# EAGLE design trig_board (EAGLE 9.2.0)
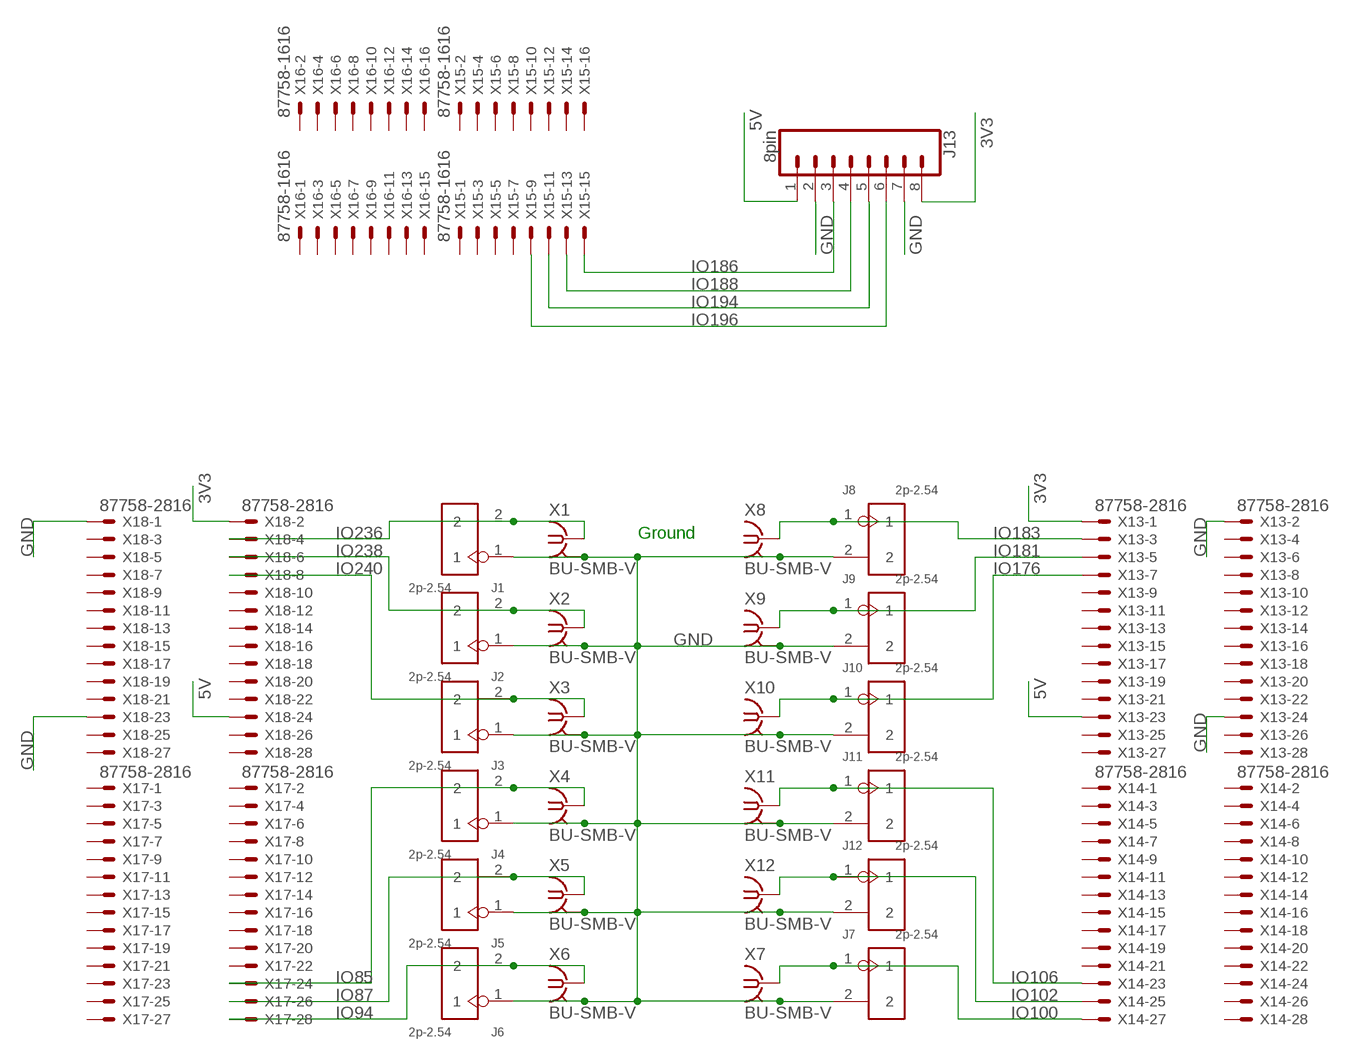
[diagram p0: schematic, sheet 1]

## Parts
J1  2p-2.54  DIP-BLACK-MALE-HEADER-VERT(2P-2.54)  [H2-2.54]
J2  2p-2.54  DIP-BLACK-MALE-HEADER-VERT(2P-2.54)  [H2-2.54]
J3  2p-2.54  DIP-BLACK-MALE-HEADER-VERT(2P-2.54)  [H2-2.54]
J4  2p-2.54  DIP-BLACK-MALE-HEADER-VERT(2P-2.54)  [H2-2.54]
J5  2p-2.54  DIP-BLACK-MALE-HEADER-VERT(2P-2.54)  [H2-2.54]
J6  2p-2.54  DIP-BLACK-MALE-HEADER-VERT(2P-2.54)  [H2-2.54]
J7  2p-2.54  DIP-BLACK-MALE-HEADER-VERT(2P-2.54)  [H2-2.54]
J8  2p-2.54  DIP-BLACK-MALE-HEADER-VERT(2P-2.54)  [H2-2.54]
J9  2p-2.54  DIP-BLACK-MALE-HEADER-VERT(2P-2.54)  [H2-2.54]
J10  2p-2.54  DIP-BLACK-MALE-HEADER-VERT(2P-2.54)  [H2-2.54]
J11  2p-2.54  DIP-BLACK-MALE-HEADER-VERT(2P-2.54)  [H2-2.54]
J12  2p-2.54  DIP-BLACK-MALE-HEADER-VERT(2P-2.54)  [H2-2.54]
J13  8pin  CONN_08"  [1X08]
X1  BU-SMB-V  [BU-SMB-V]
X2  BU-SMB-V  [BU-SMB-V]
X3  BU-SMB-V  [BU-SMB-V]
X4  BU-SMB-V  [BU-SMB-V]
X5  BU-SMB-V  [BU-SMB-V]
X6  BU-SMB-V  [BU-SMB-V]
X7  BU-SMB-V  [BU-SMB-V]
X8  BU-SMB-V  [BU-SMB-V]
X9  BU-SMB-V  [BU-SMB-V]
X10  BU-SMB-V  [BU-SMB-V]
X11  BU-SMB-V  [BU-SMB-V]
X12  BU-SMB-V  [BU-SMB-V]
X13  87758-2816  [87758-2816]
X14  87758-2816  [87758-2816]
X15  87758-1616  [87758-1616]
X16  87758-1616  [87758-1616]
X17  87758-2816  [87758-2816]
X18  87758-2816  [87758-2816]

## Nets
3V3: J13.8 X13.1 X18.2
5V: J13.1 X13.23 X18.24
GND: J1.1 J2.1 J3.1 J4.1 J5.1 J6.1 J7.2 J8.2 J9.2 J10.2 J11.2 J12.2 J13.2 J13.7 X1.2 X1.3 X1.4 X1.5 X2.2 X2.3 X2.4 X2.5 X3.2 X3.3 X3.4 X3.5 X4.2 X4.3 X4.4 X4.5 X5.2 X5.3 X5.4 X5.5 X6.2 X6.3 X6.4 X6.5 X7.2 X7.3 X7.4 X7.5 X8.2 X8.3 X8.4 X8.5 X9.2 X9.3 X9.4 X9.5 X10.2 X10.3 X10.4 X10.5 X11.2 X11.3 X11.4 X11.5 X12.2 X12.3 X12.4 X12.5 X13.2 X13.24 X18.1 X18.23
IO85: J4.2 X4.1 X17.24
IO87: J5.2 X5.1 X17.26
IO94: J6.2 X6.1 X17.28
IO100: J7.1 X7.1 X14.27
IO102: J12.1 X12.1 X14.25
IO106: J11.1 X11.1 X14.23
IO176: J10.1 X10.1 X13.7
IO181: J9.1 X9.1 X13.5
IO183: J8.1 X8.1 X13.3
IO186: J13.3 X15.15
IO188: J13.4 X15.13
IO194: J13.5 X15.11
IO196: J13.6 X15.9
IO236: J1.2 X1.1 X18.4
IO238: J2.2 X2.1 X18.6
IO240: J3.2 X3.1 X18.8
Unconnected: X13.4 X13.6 X13.8 X13.9 X13.10 X13.11 X13.12 X13.13 X13.14 X13.15 X13.16 X13.17 X13.18 X13.19 X13.20 X13.21 X13.22 X13.25 X13.26 X13.27 X13.28 X14.1 X14.2 X14.3 X14.4 X14.5 X14.6 X14.7 X14.8 X14.9 X14.10 X14.11 X14.12 X14.13 X14.14 X14.15 X14.16 X14.17 X14.18 X14.19 X14.20 X14.21 X14.22 X14.24 X14.26 X14.28 X15.1 X15.2 X15.3 X15.4 X15.5 X15.6 X15.7 X15.8 X15.10 X15.12 X15.14 X15.16 X16.1 X16.2 X16.3 X16.4 X16.5 X16.6 X16.7 X16.8 X16.9 X16.10 X16.11 X16.12 X16.13 X16.14 X16.15 X16.16 X17.1 X17.2 X17.3 X17.4 X17.5 X17.6 X17.7 X17.8 X17.9 X17.10 X17.11 X17.12 X17.13 X17.14 X17.15 X17.16 X17.17 X17.18 X17.19 X17.20 X17.21 X17.22 X17.23 X17.25 X17.27 X18.3 X18.5 X18.7 X18.9 X18.10 X18.11 X18.12 X18.13 X18.14 X18.15 X18.16 X18.17 X18.18 X18.19 X18.20 X18.21 X18.22 X18.25 X18.26 X18.27 X18.28

## Notes on the sheet
- Ground

## Library data of the parts
J1-J12 = Seeed-Connector:DIP-BLACK-MALE-HEADER-VERT(2P-2.54): 320020016; MPN: P125-1102A0BS116A1
J13 = SparkFun-Connectors:CONN_08: Multi connection point. Often used as Generic Header-pin footprint for 0.1 inch spaced/style header connections On any of the 0.1 inch spaced packages, you can populate with these: Break Away Headers - Straight <https://www.sparkfun.com/products/116> (PRT-00116) Break Away Male Headers - Right Angle <https://www.sparkfun.com/products/553> (PRT-00553) Female Headers <https://www.sparkfun.com/products/115> (PRT-00115) Break Away Headers - Machine Pin <https://www.sparkfun.com/products/117> (PRT-00117) Break Away Female Headers - Swiss Machine Pin <https://www.sparkfun.com/products/743> (PRT-00743) Arduino Stackable Header - 8 Pin <https://www.sparkfun.com/products/9279> (PRT-09279) For SCREWTERMINALS and SPRING TERMINALS visit here: Screw Terimnals on SparkFun.com <https://www.sparkfun.com/search/results?term=Screw+Terminals> (5mm/3.5mm/2.54mm spacing) This device is also useful as a general connection point to wire up your design to another part of your project. Our various solder wires solder well into these plated through hole pads. Hook-Up Wire - Assortment (Stranded, 22 AWG) <https://www.sparkfun.com/products/11375> (PRT-11375) Hook-Up Wire - Assortment (Solid Core, 22 AWG) <https://www.sparkfun.com/products/11367> (PRT-11367) View the entire wire category on our website here <https://www.sparkfun.com/categories/141> Special notes: Molex polarized connector foot print use with SKU : PRT-08231 with associated crimp pins and housings. 1MM SMD Version SKU: PRT-10208 NOTES ON THE VARIANTS LOCK and LOCK_LONGPADS... This footprint was designed to help hold the alignment of a through-hole component (i.e. 6-pin header) while soldering it into place. You may notice that each hole has been shifted either up or down by 0.005 of an inch from it's more standard position (which is a perfectly straight line). This slight alteration caused the pins (the squares in the middle) to touch the edges of the holes. Because they are alternating, it causes a "brace" to hold the component in place. 0.005 has proven to be the perfect amount of "off-center" position when using our standard breakaway headers. Although looks a little odd when you look at the bare footprint, once you have a header in there, the alteration is very hard to notice. Also,if you push a header all the way into place, it is covered up entirely on the bottom side.; PROD_ID: CONN-08438
X1-X12 = con-coax:BU-SMB-V: FEMALE SMB CONNECTOR Radiall distributor RS 112-2993; OC_FARNELL: unknown; OC_NEWARK: unknown
X13 X14 X17 X18 = con-molex:87758-2816: 28 Pin - 2mm Dual Row Single Wafer, Vertical T/H HDR Source: http://www.molex.com/pdm_docs/sd/877580616_sd.pdf; MF: MOLEX; MPN: 87758-2816; OC_FARNELL: unknown; OC_NEWARK: 25M5681
X15 X16 = con-molex:87758-1616: 16 Pin - 2mm Dual Row Single Wafer, Vertical T/H HDR Source: http://www.molex.com/pdm_docs/sd/877580616_sd.pdf; MF: MOLEX; MPN: 87758-1616; OC_FARNELL: 7472366; OC_NEWARK: 59J1563

## Board
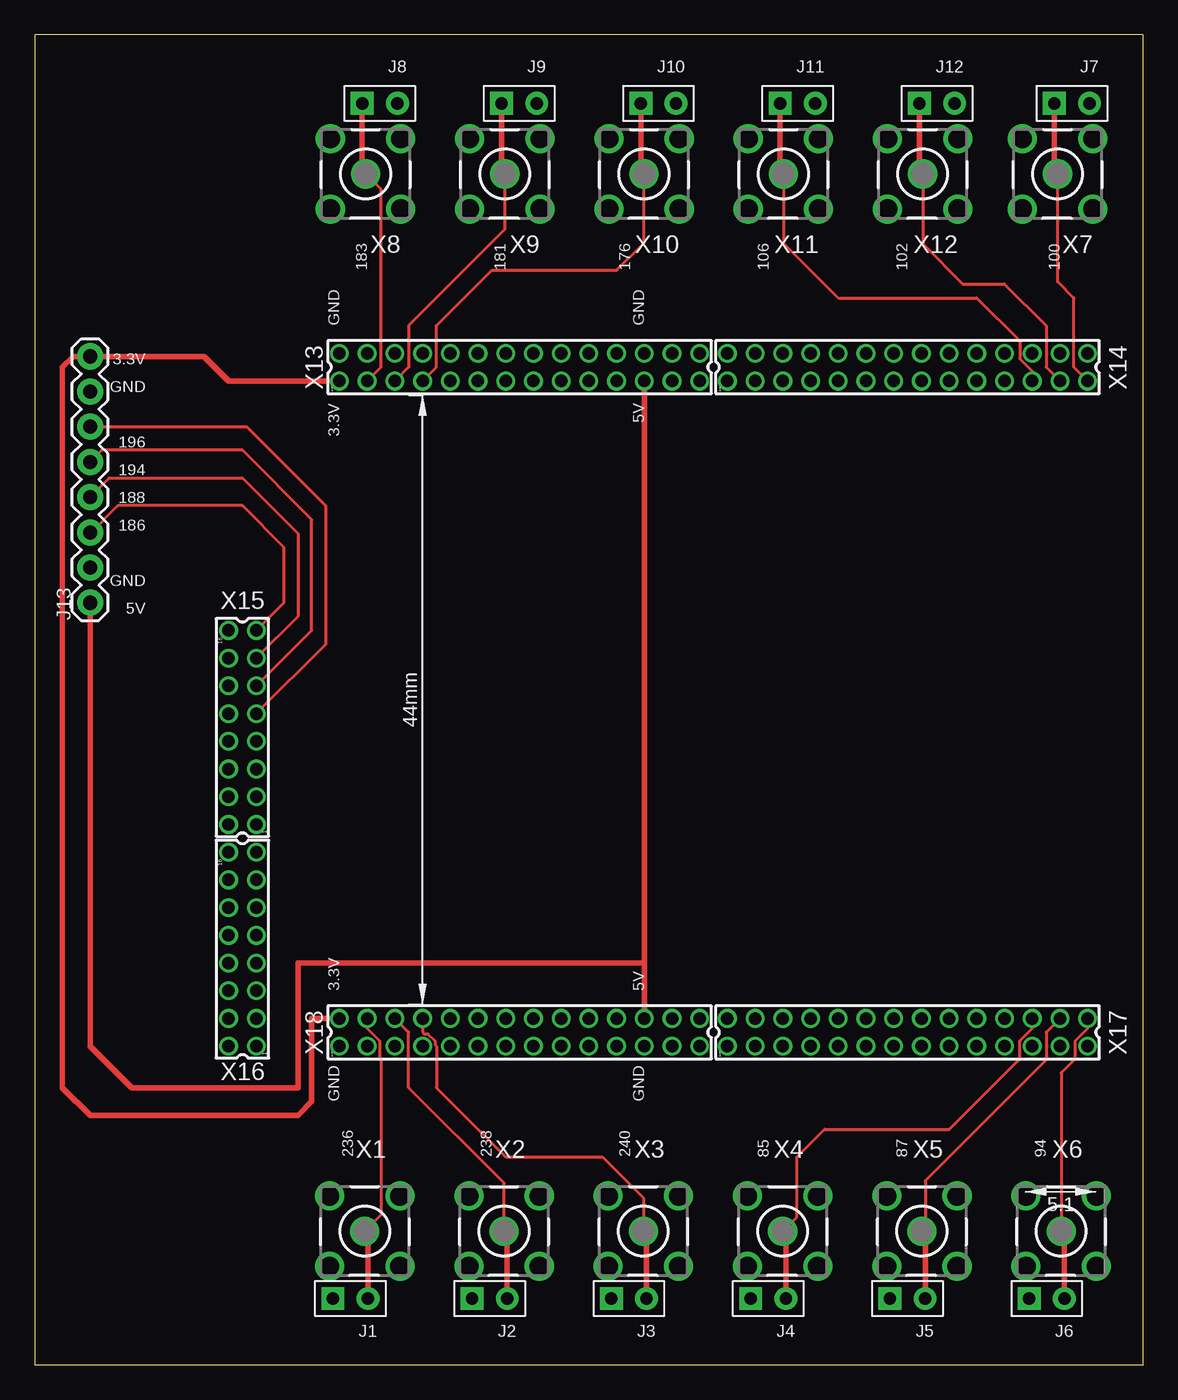
[diagram p1: board, top side]
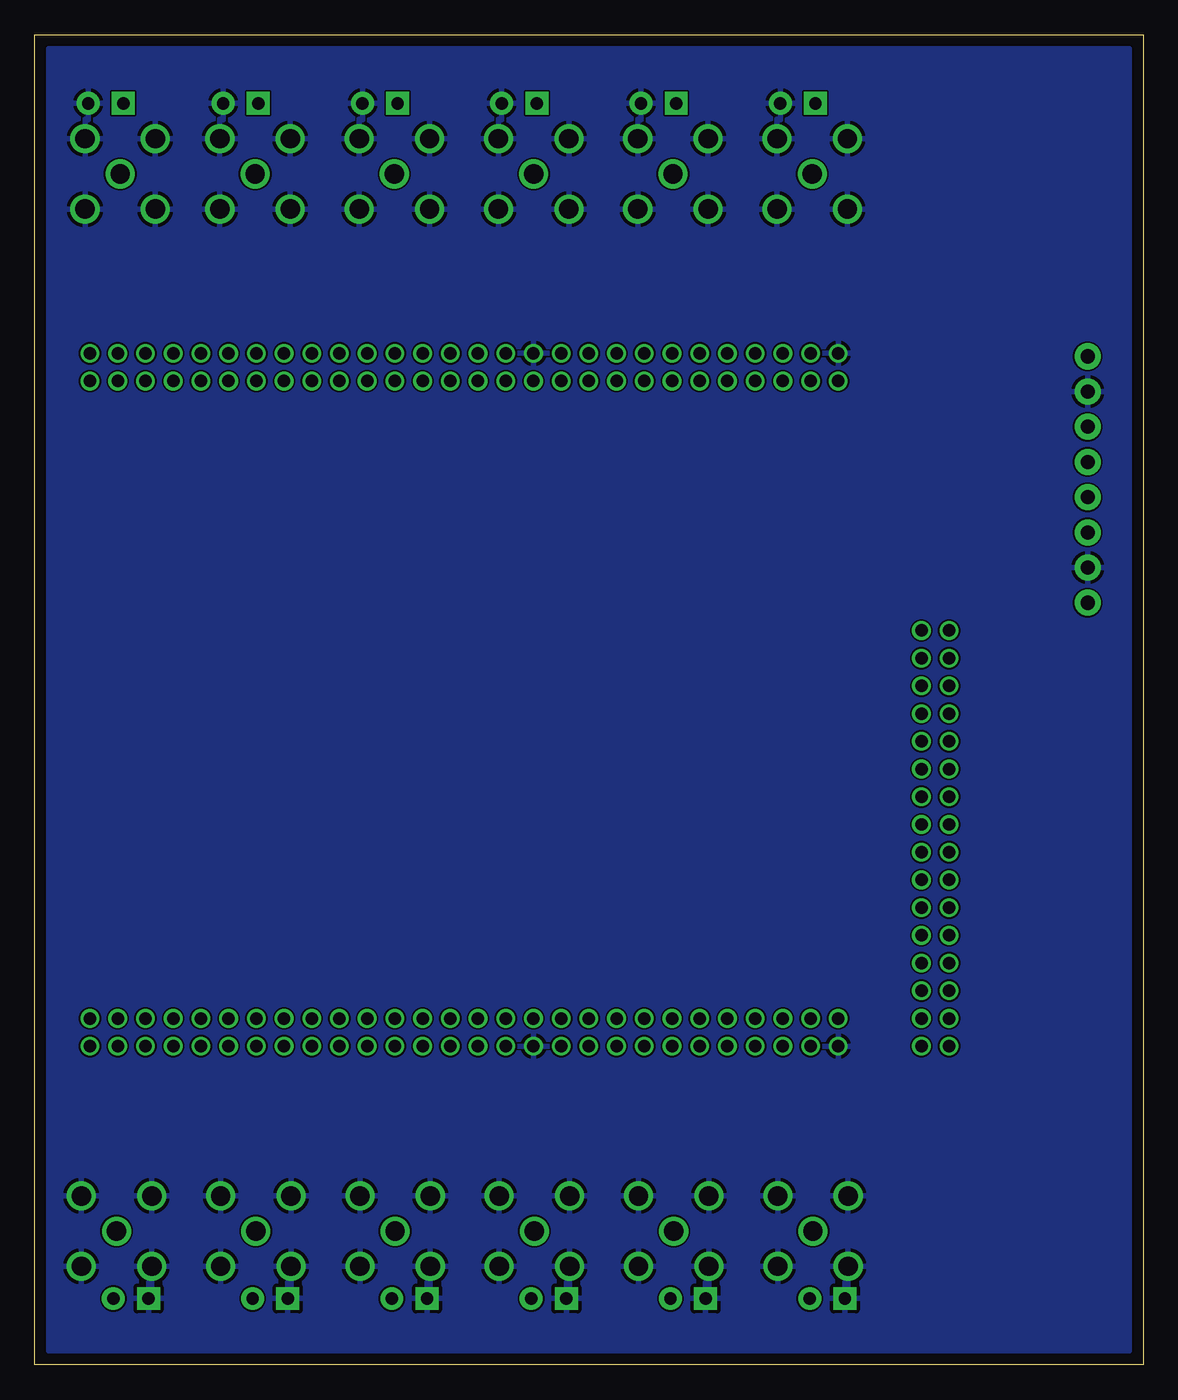
[diagram p2: board, bottom side, seen from below]

Size 80 x 96 mm. Coordinates in mm from the lower left corner, seen from the top.
Outline: 0,0 80,0 80,96 0,96 0,0
Copper layers (1*16): Top 0.035mm / dielectric 1.5mm / Bottom 0.035mm
Design rules "MF_Standard_2_Layer": minimum track width 5mil, minimum drill 12mil, track to track 5mil, track to pad 5mil, pad to pad 5mil, via to via 5mil, smd to smd 0mil, copper to edge 10mil, drill to drill 10mil, minimum pad ring 6mil, minimum via ring 6mil, stop-mask expansion 2mil, vias tented up to drill 25mil, thermal gap 10mil

### Footprints (pad centres in the part's own frame; a part is rotated, then mirrored left to right if it is on the bottom)
H2-2.54 = drill 0.889 pad 1.651 square: 1 0,1.27 | drill 0.889 pad 1.651: 2 0,-1.27
1X08 = drill 1.016 pad 1.88: 1 0,0; 2 2.54,0; 3 5.08,0; 4 7.62,0; 5 10.16,0; 6 12.7,0; 7 15.24,0; 8 17.78,0
BU-SMB-V = drill 1.4: 1 0,0; 2 -2.54,2.54; 3 2.54,2.54; 4 2.54,-2.54; 5 -2.54,-2.54
87758-2816 = drill 0.9 pad 1.27: 1 -13,-1; 2 -13,1; 3 -11,-1; 4 -11,1; 5 -9,-1; 6 -9,1; 7 -7,-1; 8 -7,1; 9 -5,-1; 10 -5,1; 11 -3,-1; 12 -3,1; 13 -1,-1; 14 -1,1; 15 1,-1; 16 1,1; 17 3,-1; 18 3,1; 19 5,-1; 20 5,1; 21 7,-1; 22 7,1; 23 9,-1; 24 9,1; 25 11,-1; 26 11,1; 27 13,-1; 28 13,1
87758-1616 = drill 0.9 pad 1.27: 1 -7,-1; 2 -7,1; 3 -5,-1; 4 -5,1; 5 -3,-1; 6 -3,1; 7 -1,-1; 8 -1,1; 9 1,-1; 10 1,1; 11 3,-1; 12 3,1; 13 5,-1; 14 5,1; 15 7,-1; 16 7,1

### Placement (x,y rotation side)
J1  22.79,4.79 90 top
J2  32.84,4.79 90 top
J3  42.89,4.79 90 top
J4  52.95,4.79 90 top
J5  63,4.79 90 top
J6  73.05,4.79 90 top
J7  74.86,91.04 90 top
J8  24.92,91.04 90 top
J9  34.97,91.04 90 top
J10  45.02,91.04 90 top
J11  55.07,91.04 90 top
J12  65.13,91.04 90 top
J13  4,55 90 top
X1  23.83,9.65 180 top
X2  33.88,9.65 180 top
X3  43.93,9.65 180 top
X4  53.98,9.65 180 top
X5  64.04,9.65 180 top
X6  74.09,9.65 180 top
X7  73.83,85.95 180 top
X8  23.88,85.95 180 top
X9  33.93,85.95 180 top
X10  43.98,85.95 180 top
X11  54.04,85.95 180 top
X12  64.09,85.95 180 top
X13  35,72 0 top
X14  63,72 0 top
X15  15,46 90 top
X16  15,30 90 top
X17  63,24 0 top
X18  35,24 0 top

### Tracks (layer width: path | path; a pad name or v marks a point on that pad's centre or on a via)
3V3
  Top 0.406: X13.1 14,71 12.22,72.78 J13.8 2.78,72.78 2,72 2,20 4,18 19,18 20,19 20,25 X18.2
5V
  Top 0.406: X13.23 44,29 | 44,29 X18.24 | 44,29 19,29 19,20 7,20 4,23 J13.1
GND
  pour Bottom: 1,95 79,95 79,1 1,1
IO85
  Top 0.2: X4.1 55,10.67 55,15 57,17 66,17 71.1,22.1 71.1,23.37 72,24.28 X17.24
  Top 0.406: J4.2 54.22,9.42 X4.1
IO87
  Top 0.2: X17.26 73,24 73,22 64.27,13.27 64.27,9.42
  Top 0.406: J5.2 64.27,9.42 X5.1
IO94
  Top 0.2: X6.1 74.09,21.09 75.1,22.1 75.1,23.37 76,24.28 X17.28
  Top 0.406: X6.1 74.32,9.43 J6.2
IO100
  Top 0.2: X14.27 75,72 75,77 73.83,78.17 X7.1
  Top 0.406: J7.1 73.59,86.18 X7.1
IO102
  Top 0.2: X12.1 64.09,80.91 67,78 70,78 73,75 73,72 X14.25
  Top 0.406: J12.1 63.86,86.18 X12.1
IO106
  Top 0.2: X11.1 54.04,80.96 58,77 68,77 71.1,73.9 71.1,72.63 72,71.72 X14.23
  Top 0.406: J11.1 53.8,86.18 X11.1
IO176
  Top 0.2: X13.7 29,72 29,75 33,79 42,79 43.97,80.97 43.97,85.97
  Top 0.406: J10.1 43.75,86.18 43.97,85.97 X10.1
IO181
  Top 0.2: X9.1 33.93,81.93 27,75 27,72 X13.5
  Top 0.406: J9.1 33.7,86.18 X9.1
IO183
  Top 0.2: X13.3 25,72 25,84.83 X8.1
  Top 0.406: X8.1 23.65,86.18 J8.1
IO186
  Top 0.2: X15.15 18,55 18,59 15,62 6,62 4.08,60.08
  Top 0.406: 4.08,60.08 J13.3
IO188
  Top 0.2: J13.4 5.38,64 15,64 19,60 19,54 X15.13
IO194
  Top 0.2: X15.11 20,53 20,61 15,66 4.84,66 J13.5
IO196
  Top 0.2: J13.6 15.3,67.7 21,62 21,52 X15.9
IO236
  Top 0.2: X18.4 24,24.28 24.9,23.37 24.9,22.1 25,22 25,10.82 X1.1
  Top 0.406: J1.2 24.06,9.42 X1.1
IO238
  Top 0.2: X2.1 33.88,13.12 27,20 27,24 X18.6
  Top 0.406: J2.2 34.11,9.42 X2.1
IO240
  Top 0.2: X18.8 28,24 28.1,23.9 28.37,23.9 28.9,23.37 28.9,23.1 29,23 29,20 34,15 41,15 43.93,12.07 X3.1
  Top 0.406: J3.2 44.16,9.42 X3.1

### Text on the board
tPlace: 183 | 181 | 176 | 106 | 102 | 100 | GND | GND | 3.3V | GND | 5V | 196 | 3.3V | 194 | 188 | 186 | GND | 5V | 3.3V | 5V | GND | GND | 236 | 238 | 240 | 85 | 87 | 94